# EAGLE schematic module_RevC_panelized (EAGLE 9.1.1)
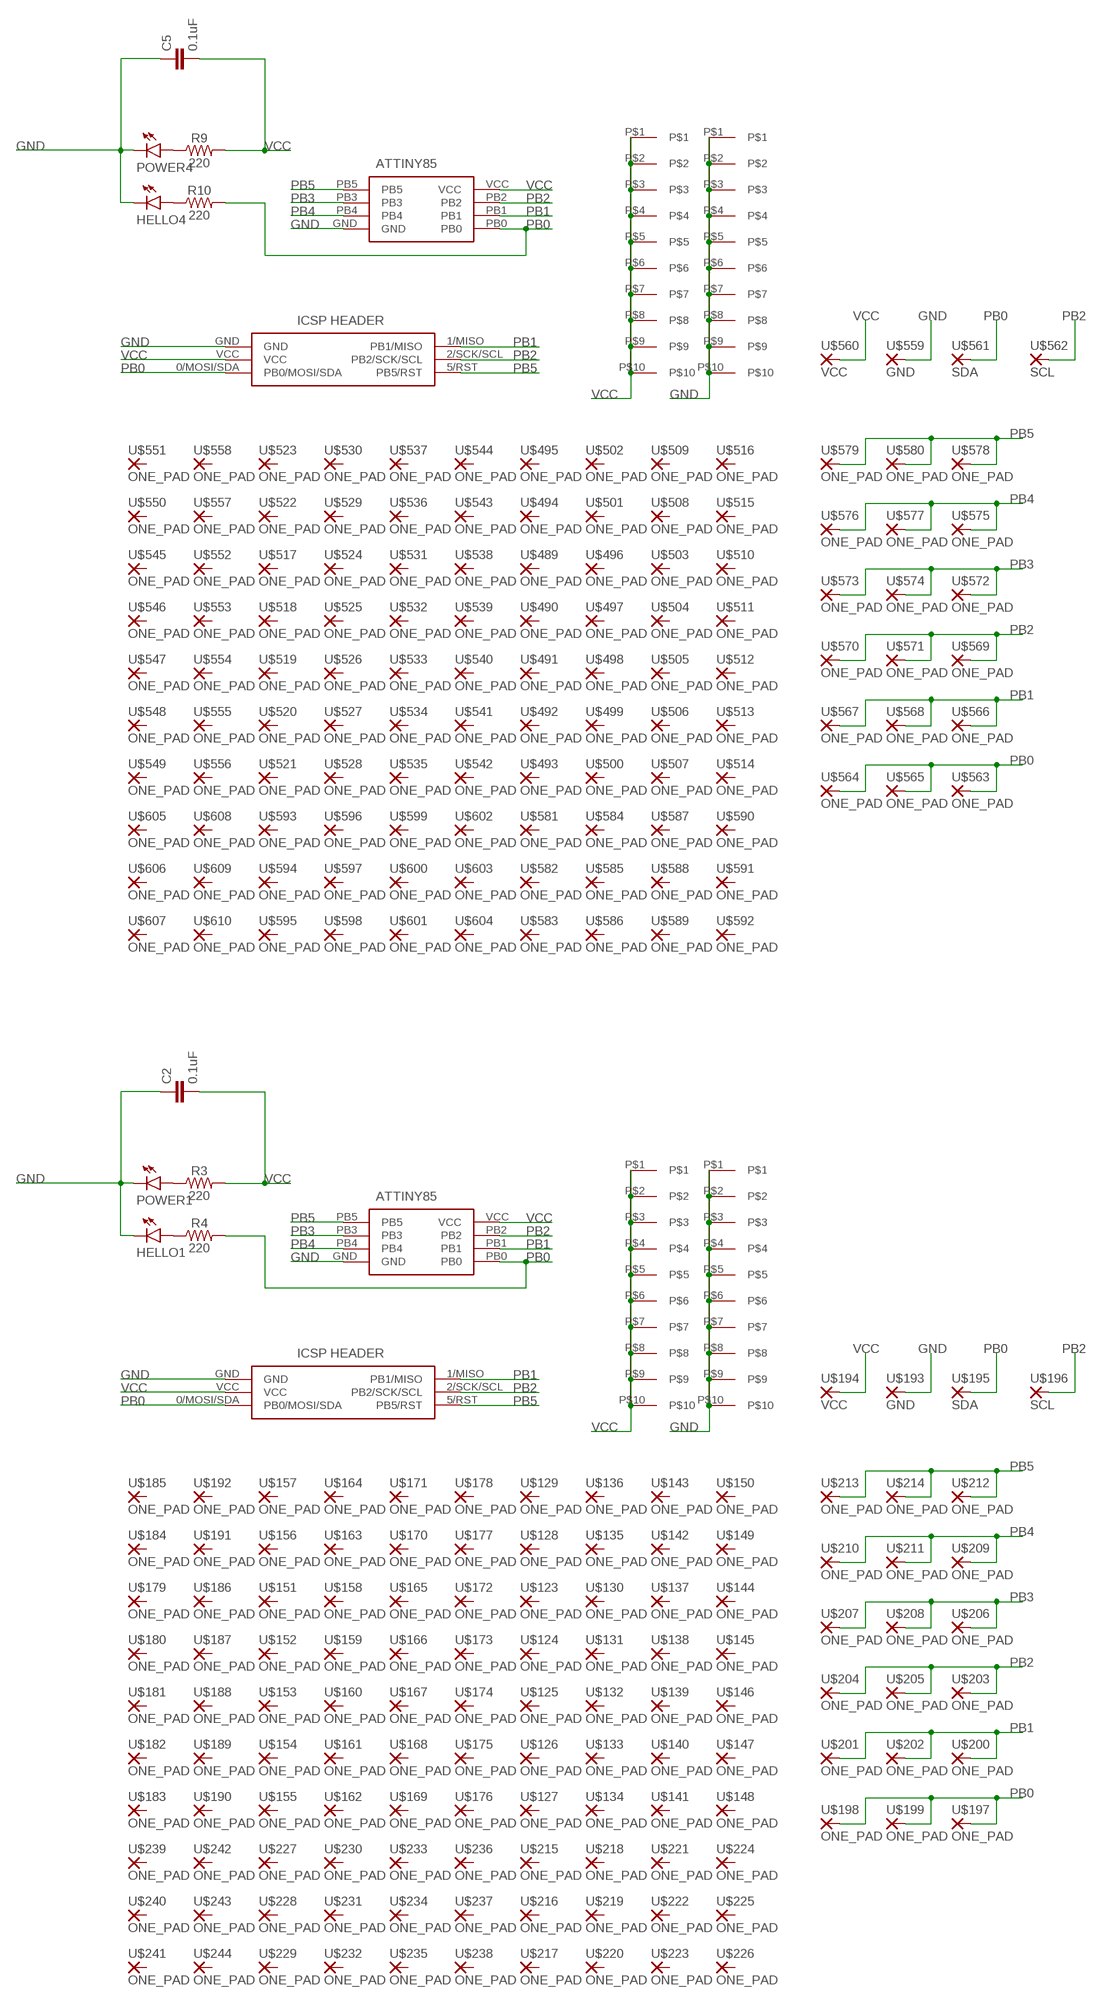
[diagram p0: schematic, sheet 1, part 1 of 2]
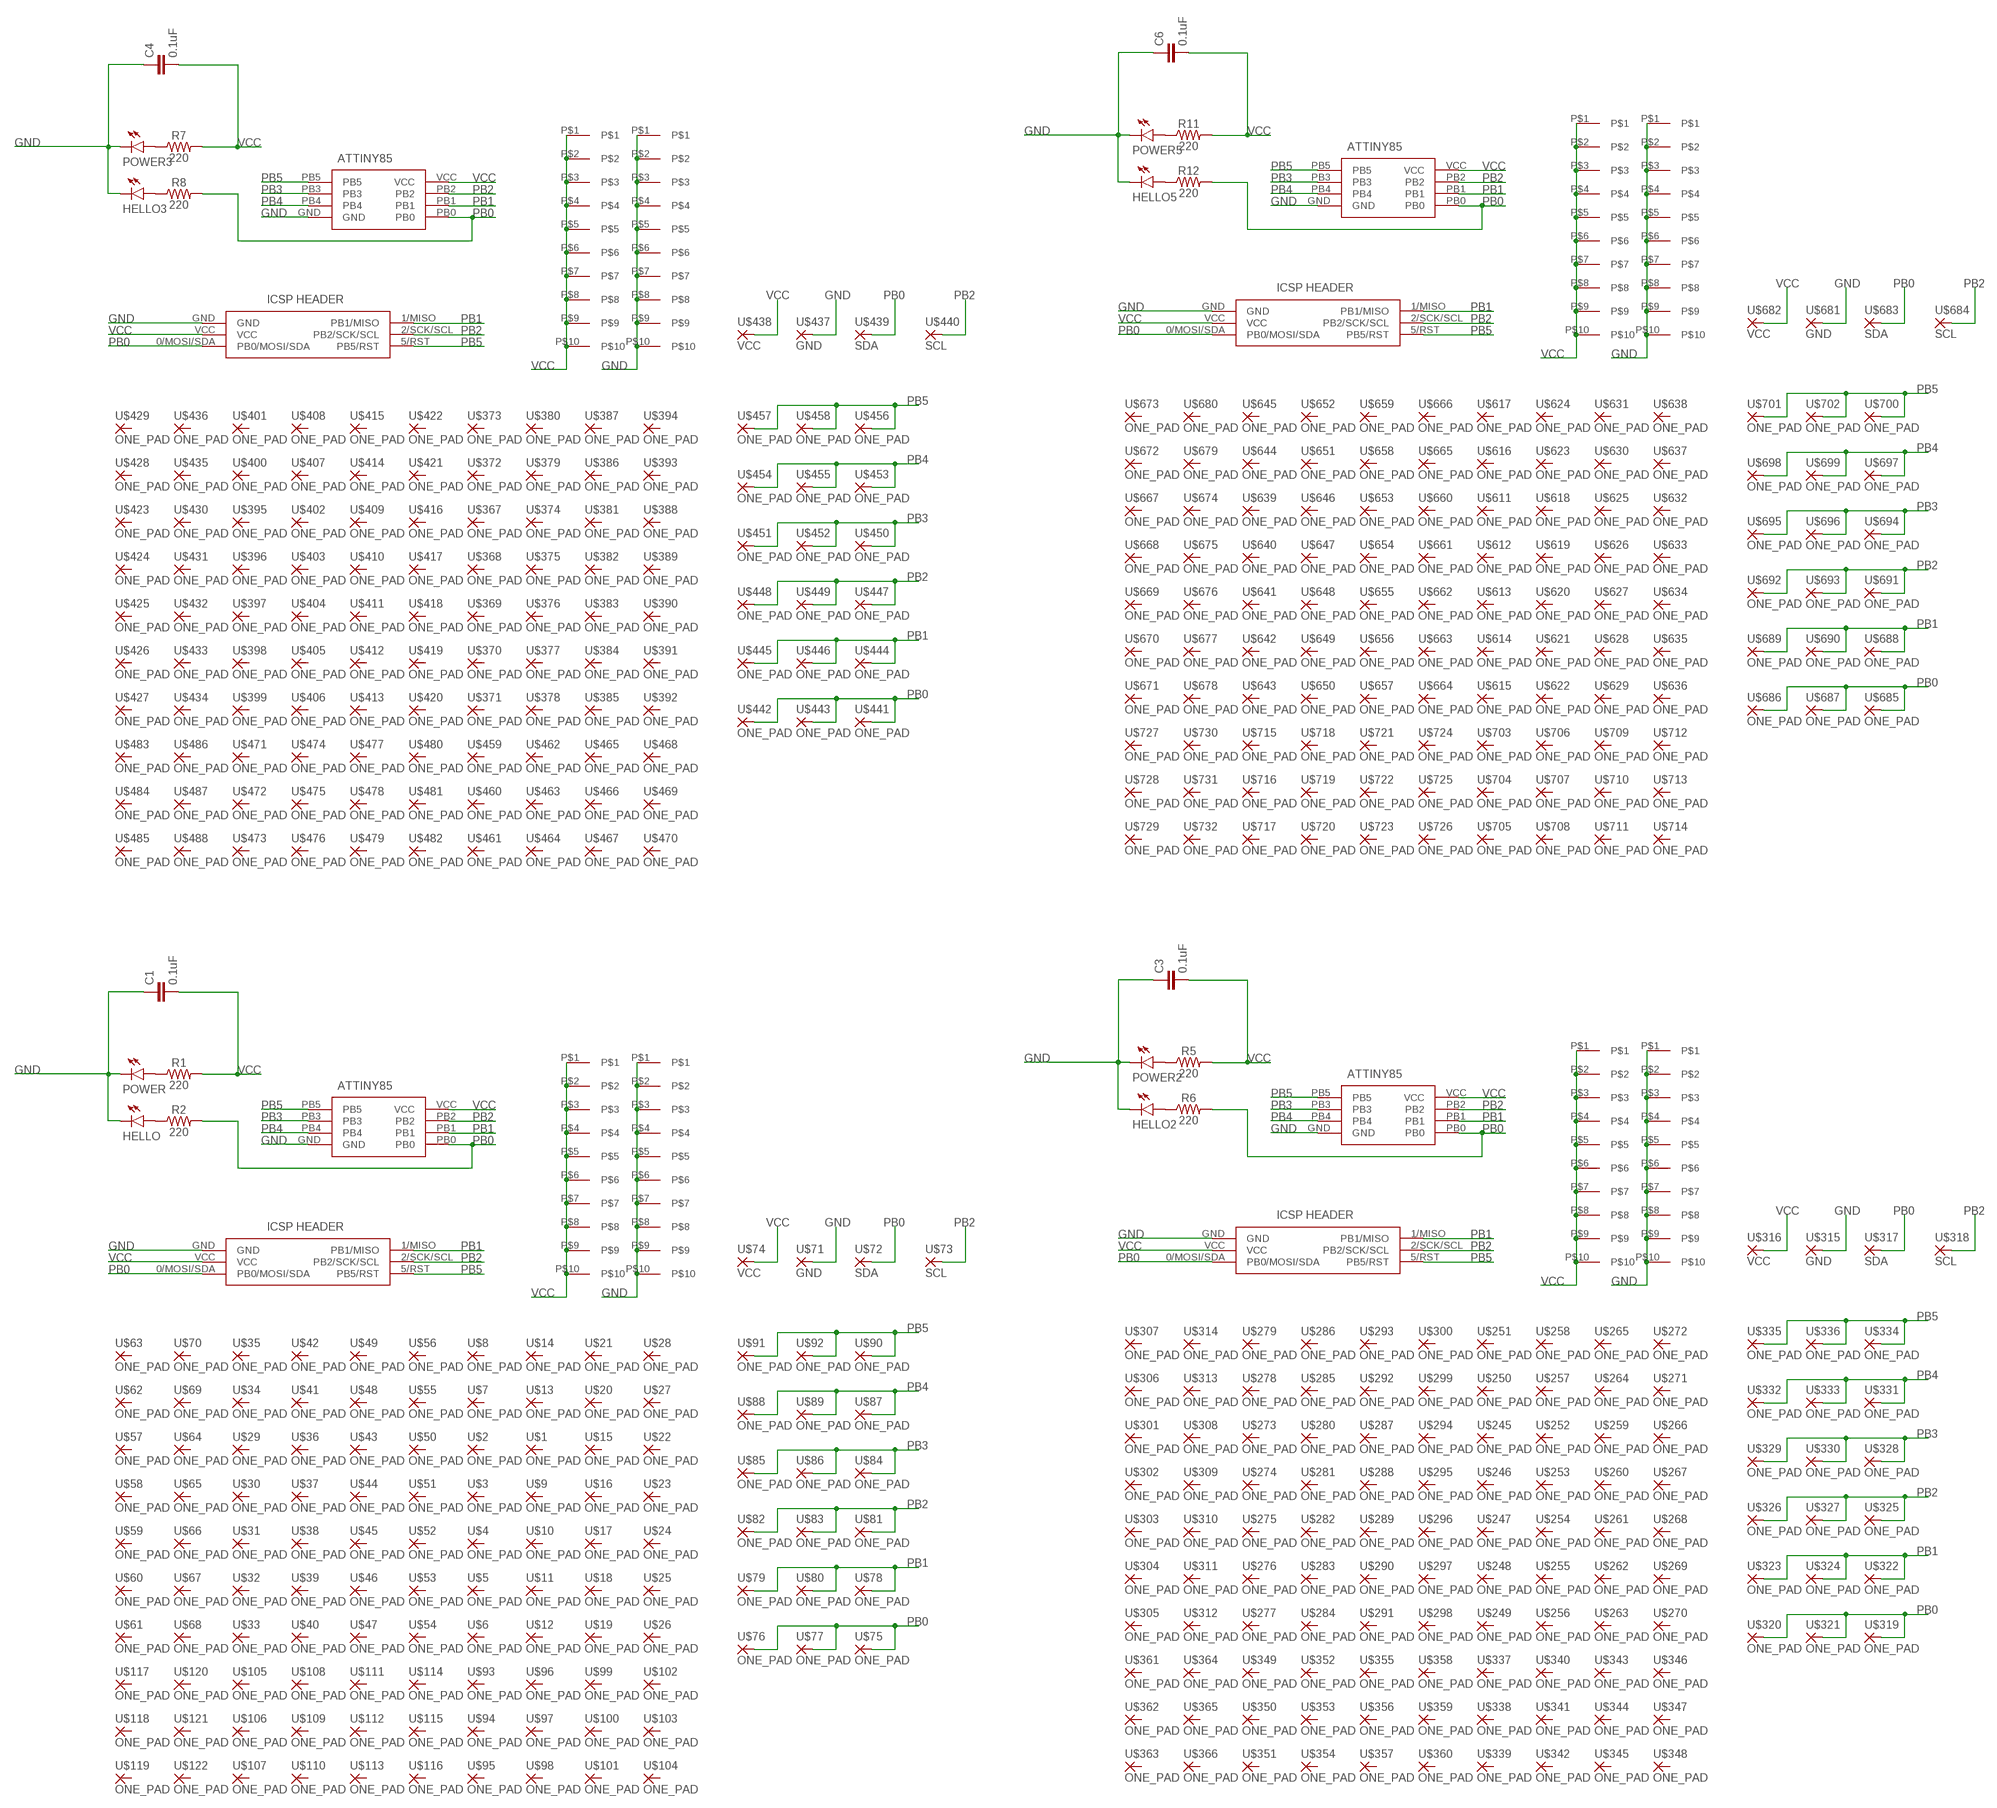
[diagram p1: schematic, sheet 1, part 2 of 2]

## Parts
C1  0.1uF  0.1UF-0603-25V-5%  [0603]
C2  0.1uF  0.1UF-0603-25V-5%  [0603]
C3  0.1uF  0.1UF-0603-25V-5%  [0603]
C4  0.1uF  0.1UF-0603-25V-5%  [0603]
C5  0.1uF  0.1UF-0603-25V-5%  [0603]
C6  0.1uF  0.1UF-0603-25V-5%  [0603]
GND  10X-PADS  [10X-PADS]
GND1  10X-PADS  [10X-PADS]
GND2  10X-PADS  [10X-PADS]
GND3  10X-PADS  [10X-PADS]
GND4  10X-PADS  [10X-PADS]
GND5  10X-PADS  [10X-PADS]
HELLO  LED3MM  [LED3MM]
HELLO1  LED3MM  [LED3MM]
HELLO2  LED3MM  [LED3MM]
HELLO3  LED3MM  [LED3MM]
HELLO4  LED3MM  [LED3MM]
HELLO5  LED3MM  [LED3MM]
IC1  ATTINY85-20SU  [SOT127P798X216-8N]
IC2  ATTINY85-20SU  [SOT127P798X216-8N]
IC3  ATTINY85-20SU  [SOT127P798X216-8N]
IC4  ATTINY85-20SU  [SOT127P798X216-8N]
IC5  ATTINY85-20SU  [SOT127P798X216-8N]
IC6  ATTINY85-20SU  [SOT127P798X216-8N]
J1  M20-9980346  [HDRV6W64P254_2X3_762X508X868P]
J2  M20-9980346  [HDRV6W64P254_2X3_762X508X868P]
J3  M20-9980346  [HDRV6W64P254_2X3_762X508X868P]
J4  M20-9980346  [HDRV6W64P254_2X3_762X508X868P]
J5  M20-9980346  [HDRV6W64P254_2X3_762X508X868P]
J6  M20-9980346  [HDRV6W64P254_2X3_762X508X868P]
POWER  LED3MM  [LED3MM]
POWER1  LED3MM  [LED3MM]
POWER2  LED3MM  [LED3MM]
POWER3  LED3MM  [LED3MM]
POWER4  LED3MM  [LED3MM]
POWER5  LED3MM  [LED3MM]
R1  220  RESISTORAXIAL-0.3  [AXIAL-0.3]
R2  220  RESISTORAXIAL-0.3  [AXIAL-0.3]
R3  220  RESISTORAXIAL-0.3  [AXIAL-0.3]
R4  220  RESISTORAXIAL-0.3  [AXIAL-0.3]
R5  220  RESISTORAXIAL-0.3  [AXIAL-0.3]
R6  220  RESISTORAXIAL-0.3  [AXIAL-0.3]
R7  220  RESISTORAXIAL-0.3  [AXIAL-0.3]
R8  220  RESISTORAXIAL-0.3  [AXIAL-0.3]
R9  220  RESISTORAXIAL-0.3  [AXIAL-0.3]
R10  220  RESISTORAXIAL-0.3  [AXIAL-0.3]
R11  220  RESISTORAXIAL-0.3  [AXIAL-0.3]
R12  220  RESISTORAXIAL-0.3  [AXIAL-0.3]
U$1  ONE_PAD  [1X01]
U$2  ONE_PAD  [1X01]
U$3  ONE_PAD  [1X01]
U$4  ONE_PAD  [1X01]
U$5  ONE_PAD  [1X01]
U$6  ONE_PAD  [1X01]
U$7  ONE_PAD  [1X01]
U$8  ONE_PAD  [1X01]
U$9  ONE_PAD  [1X01]
U$10  ONE_PAD  [1X01]
U$11  ONE_PAD  [1X01]
U$12  ONE_PAD  [1X01]
U$13  ONE_PAD  [1X01]
U$14  ONE_PAD  [1X01]
U$15  ONE_PAD  [1X01]
U$16  ONE_PAD  [1X01]
U$17  ONE_PAD  [1X01]
U$18  ONE_PAD  [1X01]
U$19  ONE_PAD  [1X01]
U$20  ONE_PAD  [1X01]
U$21  ONE_PAD  [1X01]
U$22  ONE_PAD  [1X01]
U$23  ONE_PAD  [1X01]
U$24  ONE_PAD  [1X01]
U$25  ONE_PAD  [1X01]
U$26  ONE_PAD  [1X01]
U$27  ONE_PAD  [1X01]
U$28  ONE_PAD  [1X01]
U$29  ONE_PAD  [1X01]
U$30  ONE_PAD  [1X01]
U$31  ONE_PAD  [1X01]
U$32  ONE_PAD  [1X01]
U$33  ONE_PAD  [1X01]
U$34  ONE_PAD  [1X01]
U$35  ONE_PAD  [1X01]
U$36  ONE_PAD  [1X01]
U$37  ONE_PAD  [1X01]
U$38  ONE_PAD  [1X01]
U$39  ONE_PAD  [1X01]
U$40  ONE_PAD  [1X01]
U$41  ONE_PAD  [1X01]
U$42  ONE_PAD  [1X01]
U$43  ONE_PAD  [1X01]
U$44  ONE_PAD  [1X01]
U$45  ONE_PAD  [1X01]
U$46  ONE_PAD  [1X01]
U$47  ONE_PAD  [1X01]
U$48  ONE_PAD  [1X01]
U$49  ONE_PAD  [1X01]
U$50  ONE_PAD  [1X01]
U$51  ONE_PAD  [1X01]
U$52  ONE_PAD  [1X01]
U$53  ONE_PAD  [1X01]
U$54  ONE_PAD  [1X01]
U$55  ONE_PAD  [1X01]
U$56  ONE_PAD  [1X01]
U$57  ONE_PAD  [1X01]
U$58  ONE_PAD  [1X01]
U$59  ONE_PAD  [1X01]
U$60  ONE_PAD  [1X01]
U$61  ONE_PAD  [1X01]
U$62  ONE_PAD  [1X01]
U$63  ONE_PAD  [1X01]
U$64  ONE_PAD  [1X01]
U$65  ONE_PAD  [1X01]
U$66  ONE_PAD  [1X01]
U$67  ONE_PAD  [1X01]
U$68  ONE_PAD  [1X01]
U$69  ONE_PAD  [1X01]
U$70  ONE_PAD  [1X01]
U$71  GND  ONE_PAD  [1X01]
U$72  SDA  ONE_PAD  [1X01]
U$73  SCL  ONE_PAD  [1X01]
U$74  VCC  ONE_PAD  [1X01]
U$75  ONE_PAD  [1X01]
U$76  ONE_PAD  [1X01]
U$77  ONE_PAD  [1X01]
U$78  ONE_PAD  [1X01]
U$79  ONE_PAD  [1X01]
U$80  ONE_PAD  [1X01]
U$81  ONE_PAD  [1X01]
U$82  ONE_PAD  [1X01]
U$83  ONE_PAD  [1X01]
U$84  ONE_PAD  [1X01]
U$85  ONE_PAD  [1X01]
U$86  ONE_PAD  [1X01]
U$87  ONE_PAD  [1X01]
U$88  ONE_PAD  [1X01]
U$89  ONE_PAD  [1X01]
U$90  ONE_PAD  [1X01]
U$91  ONE_PAD  [1X01]
U$92  ONE_PAD  [1X01]
U$93  ONE_PAD  [1X01]
U$94  ONE_PAD  [1X01]
U$95  ONE_PAD  [1X01]
U$96  ONE_PAD  [1X01]
U$97  ONE_PAD  [1X01]
U$98  ONE_PAD  [1X01]
U$99  ONE_PAD  [1X01]
U$100  ONE_PAD  [1X01]
U$101  ONE_PAD  [1X01]
U$102  ONE_PAD  [1X01]
U$103  ONE_PAD  [1X01]
U$104  ONE_PAD  [1X01]
U$105  ONE_PAD  [1X01]
U$106  ONE_PAD  [1X01]
U$107  ONE_PAD  [1X01]
U$108  ONE_PAD  [1X01]
U$109  ONE_PAD  [1X01]
U$110  ONE_PAD  [1X01]
U$111  ONE_PAD  [1X01]
U$112  ONE_PAD  [1X01]
U$113  ONE_PAD  [1X01]
U$114  ONE_PAD  [1X01]
U$115  ONE_PAD  [1X01]
U$116  ONE_PAD  [1X01]
U$117  ONE_PAD  [1X01]
U$118  ONE_PAD  [1X01]
U$119  ONE_PAD  [1X01]
U$120  ONE_PAD  [1X01]
U$121  ONE_PAD  [1X01]
U$122  ONE_PAD  [1X01]
U$123  ONE_PAD  [1X01]
U$124  ONE_PAD  [1X01]
U$125  ONE_PAD  [1X01]
U$126  ONE_PAD  [1X01]
U$127  ONE_PAD  [1X01]
U$128  ONE_PAD  [1X01]
U$129  ONE_PAD  [1X01]
U$130  ONE_PAD  [1X01]
U$131  ONE_PAD  [1X01]
U$132  ONE_PAD  [1X01]
U$133  ONE_PAD  [1X01]
U$134  ONE_PAD  [1X01]
U$135  ONE_PAD  [1X01]
U$136  ONE_PAD  [1X01]
U$137  ONE_PAD  [1X01]
U$138  ONE_PAD  [1X01]
U$139  ONE_PAD  [1X01]
U$140  ONE_PAD  [1X01]
U$141  ONE_PAD  [1X01]
U$142  ONE_PAD  [1X01]
U$143  ONE_PAD  [1X01]
U$144  ONE_PAD  [1X01]
U$145  ONE_PAD  [1X01]
U$146  ONE_PAD  [1X01]
U$147  ONE_PAD  [1X01]
U$148  ONE_PAD  [1X01]
U$149  ONE_PAD  [1X01]
U$150  ONE_PAD  [1X01]
U$151  ONE_PAD  [1X01]
U$152  ONE_PAD  [1X01]
U$153  ONE_PAD  [1X01]
U$154  ONE_PAD  [1X01]
U$155  ONE_PAD  [1X01]
U$156  ONE_PAD  [1X01]
U$157  ONE_PAD  [1X01]
U$158  ONE_PAD  [1X01]
U$159  ONE_PAD  [1X01]
U$160  ONE_PAD  [1X01]
U$161  ONE_PAD  [1X01]
U$162  ONE_PAD  [1X01]
U$163  ONE_PAD  [1X01]
U$164  ONE_PAD  [1X01]
U$165  ONE_PAD  [1X01]
U$166  ONE_PAD  [1X01]
U$167  ONE_PAD  [1X01]
U$168  ONE_PAD  [1X01]
U$169  ONE_PAD  [1X01]
U$170  ONE_PAD  [1X01]
U$171  ONE_PAD  [1X01]
U$172  ONE_PAD  [1X01]
U$173  ONE_PAD  [1X01]
U$174  ONE_PAD  [1X01]
U$175  ONE_PAD  [1X01]
U$176  ONE_PAD  [1X01]
U$177  ONE_PAD  [1X01]
U$178  ONE_PAD  [1X01]
U$179  ONE_PAD  [1X01]
U$180  ONE_PAD  [1X01]
U$181  ONE_PAD  [1X01]
U$182  ONE_PAD  [1X01]
U$183  ONE_PAD  [1X01]
U$184  ONE_PAD  [1X01]
U$185  ONE_PAD  [1X01]
U$186  ONE_PAD  [1X01]
U$187  ONE_PAD  [1X01]
U$188  ONE_PAD  [1X01]
U$189  ONE_PAD  [1X01]
U$190  ONE_PAD  [1X01]
U$191  ONE_PAD  [1X01]
U$192  ONE_PAD  [1X01]
U$193  GND  ONE_PAD  [1X01]
U$194  VCC  ONE_PAD  [1X01]
U$195  SDA  ONE_PAD  [1X01]
U$196  SCL  ONE_PAD  [1X01]
U$197  ONE_PAD  [1X01]
U$198  ONE_PAD  [1X01]
U$199  ONE_PAD  [1X01]
U$200  ONE_PAD  [1X01]
U$201  ONE_PAD  [1X01]
U$202  ONE_PAD  [1X01]
U$203  ONE_PAD  [1X01]
U$204  ONE_PAD  [1X01]
U$205  ONE_PAD  [1X01]
U$206  ONE_PAD  [1X01]
U$207  ONE_PAD  [1X01]
U$208  ONE_PAD  [1X01]
U$209  ONE_PAD  [1X01]
U$210  ONE_PAD  [1X01]
U$211  ONE_PAD  [1X01]
U$212  ONE_PAD  [1X01]
U$213  ONE_PAD  [1X01]
U$214  ONE_PAD  [1X01]
U$215  ONE_PAD  [1X01]
U$216  ONE_PAD  [1X01]
U$217  ONE_PAD  [1X01]
U$218  ONE_PAD  [1X01]
U$219  ONE_PAD  [1X01]
U$220  ONE_PAD  [1X01]
U$221  ONE_PAD  [1X01]
U$222  ONE_PAD  [1X01]
U$223  ONE_PAD  [1X01]
U$224  ONE_PAD  [1X01]
U$225  ONE_PAD  [1X01]
U$226  ONE_PAD  [1X01]
U$227  ONE_PAD  [1X01]
U$228  ONE_PAD  [1X01]
U$229  ONE_PAD  [1X01]
U$230  ONE_PAD  [1X01]
U$231  ONE_PAD  [1X01]
U$232  ONE_PAD  [1X01]
U$233  ONE_PAD  [1X01]
U$234  ONE_PAD  [1X01]
U$235  ONE_PAD  [1X01]
U$236  ONE_PAD  [1X01]
U$237  ONE_PAD  [1X01]
U$238  ONE_PAD  [1X01]
U$239  ONE_PAD  [1X01]
U$240  ONE_PAD  [1X01]
U$241  ONE_PAD  [1X01]
U$242  ONE_PAD  [1X01]
U$243  ONE_PAD  [1X01]
U$244  ONE_PAD  [1X01]
U$245  ONE_PAD  [1X01]
U$246  ONE_PAD  [1X01]
U$247  ONE_PAD  [1X01]
U$248  ONE_PAD  [1X01]
U$249  ONE_PAD  [1X01]
U$250  ONE_PAD  [1X01]
U$251  ONE_PAD  [1X01]
U$252  ONE_PAD  [1X01]
U$253  ONE_PAD  [1X01]
U$254  ONE_PAD  [1X01]
U$255  ONE_PAD  [1X01]
U$256  ONE_PAD  [1X01]
U$257  ONE_PAD  [1X01]
U$258  ONE_PAD  [1X01]
U$259  ONE_PAD  [1X01]
U$260  ONE_PAD  [1X01]
U$261  ONE_PAD  [1X01]
U$262  ONE_PAD  [1X01]
U$263  ONE_PAD  [1X01]
U$264  ONE_PAD  [1X01]
U$265  ONE_PAD  [1X01]
U$266  ONE_PAD  [1X01]
U$267  ONE_PAD  [1X01]
U$268  ONE_PAD  [1X01]
U$269  ONE_PAD  [1X01]
U$270  ONE_PAD  [1X01]
U$271  ONE_PAD  [1X01]
U$272  ONE_PAD  [1X01]
U$273  ONE_PAD  [1X01]
U$274  ONE_PAD  [1X01]
U$275  ONE_PAD  [1X01]
U$276  ONE_PAD  [1X01]
U$277  ONE_PAD  [1X01]
U$278  ONE_PAD  [1X01]
U$279  ONE_PAD  [1X01]
U$280  ONE_PAD  [1X01]
U$281  ONE_PAD  [1X01]
U$282  ONE_PAD  [1X01]
U$283  ONE_PAD  [1X01]
U$284  ONE_PAD  [1X01]
U$285  ONE_PAD  [1X01]
U$286  ONE_PAD  [1X01]
U$287  ONE_PAD  [1X01]
U$288  ONE_PAD  [1X01]
U$289  ONE_PAD  [1X01]
U$290  ONE_PAD  [1X01]
U$291  ONE_PAD  [1X01]
U$292  ONE_PAD  [1X01]
U$293  ONE_PAD  [1X01]
U$294  ONE_PAD  [1X01]
U$295  ONE_PAD  [1X01]
U$296  ONE_PAD  [1X01]
U$297  ONE_PAD  [1X01]
U$298  ONE_PAD  [1X01]
U$299  ONE_PAD  [1X01]
U$300  ONE_PAD  [1X01]
U$301  ONE_PAD  [1X01]
U$302  ONE_PAD  [1X01]
U$303  ONE_PAD  [1X01]
U$304  ONE_PAD  [1X01]
U$305  ONE_PAD  [1X01]
U$306  ONE_PAD  [1X01]
U$307  ONE_PAD  [1X01]
U$308  ONE_PAD  [1X01]
U$309  ONE_PAD  [1X01]
U$310  ONE_PAD  [1X01]
U$311  ONE_PAD  [1X01]
U$312  ONE_PAD  [1X01]
U$313  ONE_PAD  [1X01]
U$314  ONE_PAD  [1X01]
U$315  GND  ONE_PAD  [1X01]
U$316  VCC  ONE_PAD  [1X01]
U$317  SDA  ONE_PAD  [1X01]
U$318  SCL  ONE_PAD  [1X01]
U$319  ONE_PAD  [1X01]
U$320  ONE_PAD  [1X01]
U$321  ONE_PAD  [1X01]
U$322  ONE_PAD  [1X01]
U$323  ONE_PAD  [1X01]
U$324  ONE_PAD  [1X01]
U$325  ONE_PAD  [1X01]
U$326  ONE_PAD  [1X01]
U$327  ONE_PAD  [1X01]
U$328  ONE_PAD  [1X01]
U$329  ONE_PAD  [1X01]
U$330  ONE_PAD  [1X01]
U$331  ONE_PAD  [1X01]
U$332  ONE_PAD  [1X01]
U$333  ONE_PAD  [1X01]
U$334  ONE_PAD  [1X01]
U$335  ONE_PAD  [1X01]
U$336  ONE_PAD  [1X01]
U$337  ONE_PAD  [1X01]
U$338  ONE_PAD  [1X01]
U$339  ONE_PAD  [1X01]
U$340  ONE_PAD  [1X01]
U$341  ONE_PAD  [1X01]
U$342  ONE_PAD  [1X01]
U$343  ONE_PAD  [1X01]
U$344  ONE_PAD  [1X01]
U$345  ONE_PAD  [1X01]
U$346  ONE_PAD  [1X01]
U$347  ONE_PAD  [1X01]
U$348  ONE_PAD  [1X01]
U$349  ONE_PAD  [1X01]
U$350  ONE_PAD  [1X01]
U$351  ONE_PAD  [1X01]
U$352  ONE_PAD  [1X01]
U$353  ONE_PAD  [1X01]
U$354  ONE_PAD  [1X01]
U$355  ONE_PAD  [1X01]
U$356  ONE_PAD  [1X01]
U$357  ONE_PAD  [1X01]
U$358  ONE_PAD  [1X01]
U$359  ONE_PAD  [1X01]
U$360  ONE_PAD  [1X01]
U$361  ONE_PAD  [1X01]
U$362  ONE_PAD  [1X01]
U$363  ONE_PAD  [1X01]
U$364  ONE_PAD  [1X01]
U$365  ONE_PAD  [1X01]
U$366  ONE_PAD  [1X01]
U$367  ONE_PAD  [1X01]
U$368  ONE_PAD  [1X01]
U$369  ONE_PAD  [1X01]
U$370  ONE_PAD  [1X01]
U$371  ONE_PAD  [1X01]
U$372  ONE_PAD  [1X01]
U$373  ONE_PAD  [1X01]
U$374  ONE_PAD  [1X01]
U$375  ONE_PAD  [1X01]
U$376  ONE_PAD  [1X01]
U$377  ONE_PAD  [1X01]
U$378  ONE_PAD  [1X01]
U$379  ONE_PAD  [1X01]
U$380  ONE_PAD  [1X01]
U$381  ONE_PAD  [1X01]
U$382  ONE_PAD  [1X01]
U$383  ONE_PAD  [1X01]
U$384  ONE_PAD  [1X01]
U$385  ONE_PAD  [1X01]
U$386  ONE_PAD  [1X01]
U$387  ONE_PAD  [1X01]
U$388  ONE_PAD  [1X01]
U$389  ONE_PAD  [1X01]
U$390  ONE_PAD  [1X01]
U$391  ONE_PAD  [1X01]
U$392  ONE_PAD  [1X01]
U$393  ONE_PAD  [1X01]
U$394  ONE_PAD  [1X01]
U$395  ONE_PAD  [1X01]
U$396  ONE_PAD  [1X01]
U$397  ONE_PAD  [1X01]
U$398  ONE_PAD  [1X01]
U$399  ONE_PAD  [1X01]
U$400  ONE_PAD  [1X01]
U$401  ONE_PAD  [1X01]
U$402  ONE_PAD  [1X01]
U$403  ONE_PAD  [1X01]
U$404  ONE_PAD  [1X01]
U$405  ONE_PAD  [1X01]
U$406  ONE_PAD  [1X01]
U$407  ONE_PAD  [1X01]
U$408  ONE_PAD  [1X01]
U$409  ONE_PAD  [1X01]
U$410  ONE_PAD  [1X01]
U$411  ONE_PAD  [1X01]
U$412  ONE_PAD  [1X01]
U$413  ONE_PAD  [1X01]
U$414  ONE_PAD  [1X01]
U$415  ONE_PAD  [1X01]
U$416  ONE_PAD  [1X01]
U$417  ONE_PAD  [1X01]
U$418  ONE_PAD  [1X01]
U$419  ONE_PAD  [1X01]
U$420  ONE_PAD  [1X01]
U$421  ONE_PAD  [1X01]
U$422  ONE_PAD  [1X01]
U$423  ONE_PAD  [1X01]
U$424  ONE_PAD  [1X01]
U$425  ONE_PAD  [1X01]
U$426  ONE_PAD  [1X01]
U$427  ONE_PAD  [1X01]
U$428  ONE_PAD  [1X01]
U$429  ONE_PAD  [1X01]
U$430  ONE_PAD  [1X01]
U$431  ONE_PAD  [1X01]
U$432  ONE_PAD  [1X01]
U$433  ONE_PAD  [1X01]
U$434  ONE_PAD  [1X01]
U$435  ONE_PAD  [1X01]
U$436  ONE_PAD  [1X01]
U$437  GND  ONE_PAD  [1X01]
U$438  VCC  ONE_PAD  [1X01]
U$439  SDA  ONE_PAD  [1X01]
U$440  SCL  ONE_PAD  [1X01]
U$441  ONE_PAD  [1X01]
U$442  ONE_PAD  [1X01]
U$443  ONE_PAD  [1X01]
U$444  ONE_PAD  [1X01]
U$445  ONE_PAD  [1X01]
U$446  ONE_PAD  [1X01]
U$447  ONE_PAD  [1X01]
U$448  ONE_PAD  [1X01]
U$449  ONE_PAD  [1X01]
U$450  ONE_PAD  [1X01]
U$451  ONE_PAD  [1X01]
U$452  ONE_PAD  [1X01]
U$453  ONE_PAD  [1X01]
U$454  ONE_PAD  [1X01]
U$455  ONE_PAD  [1X01]
U$456  ONE_PAD  [1X01]
U$457  ONE_PAD  [1X01]
U$458  ONE_PAD  [1X01]
U$459  ONE_PAD  [1X01]
U$460  ONE_PAD  [1X01]
U$461  ONE_PAD  [1X01]
U$462  ONE_PAD  [1X01]
U$463  ONE_PAD  [1X01]
U$464  ONE_PAD  [1X01]
U$465  ONE_PAD  [1X01]
U$466  ONE_PAD  [1X01]
U$467  ONE_PAD  [1X01]
U$468  ONE_PAD  [1X01]
U$469  ONE_PAD  [1X01]
U$470  ONE_PAD  [1X01]
U$471  ONE_PAD  [1X01]
U$472  ONE_PAD  [1X01]
U$473  ONE_PAD  [1X01]
U$474  ONE_PAD  [1X01]
U$475  ONE_PAD  [1X01]
U$476  ONE_PAD  [1X01]
U$477  ONE_PAD  [1X01]
U$478  ONE_PAD  [1X01]
U$479  ONE_PAD  [1X01]
U$480  ONE_PAD  [1X01]
U$481  ONE_PAD  [1X01]
U$482  ONE_PAD  [1X01]
U$483  ONE_PAD  [1X01]
U$484  ONE_PAD  [1X01]
U$485  ONE_PAD  [1X01]
U$486  ONE_PAD  [1X01]
U$487  ONE_PAD  [1X01]
U$488  ONE_PAD  [1X01]
U$489  ONE_PAD  [1X01]
U$490  ONE_PAD  [1X01]
U$491  ONE_PAD  [1X01]
U$492  ONE_PAD  [1X01]
U$493  ONE_PAD  [1X01]
U$494  ONE_PAD  [1X01]
U$495  ONE_PAD  [1X01]
U$496  ONE_PAD  [1X01]
U$497  ONE_PAD  [1X01]
U$498  ONE_PAD  [1X01]
U$499  ONE_PAD  [1X01]
U$500  ONE_PAD  [1X01]
U$501  ONE_PAD  [1X01]
U$502  ONE_PAD  [1X01]
U$503  ONE_PAD  [1X01]
U$504  ONE_PAD  [1X01]
U$505  ONE_PAD  [1X01]
U$506  ONE_PAD  [1X01]
U$507  ONE_PAD  [1X01]
U$508  ONE_PAD  [1X01]
U$509  ONE_PAD  [1X01]
U$510  ONE_PAD  [1X01]
U$511  ONE_PAD  [1X01]
U$512  ONE_PAD  [1X01]
U$513  ONE_PAD  [1X01]
U$514  ONE_PAD  [1X01]
U$515  ONE_PAD  [1X01]
U$516  ONE_PAD  [1X01]
U$517  ONE_PAD  [1X01]
U$518  ONE_PAD  [1X01]
U$519  ONE_PAD  [1X01]
U$520  ONE_PAD  [1X01]
U$521  ONE_PAD  [1X01]
U$522  ONE_PAD  [1X01]
U$523  ONE_PAD  [1X01]
U$524  ONE_PAD  [1X01]
U$525  ONE_PAD  [1X01]
U$526  ONE_PAD  [1X01]
U$527  ONE_PAD  [1X01]
U$528  ONE_PAD  [1X01]
U$529  ONE_PAD  [1X01]
U$530  ONE_PAD  [1X01]
U$531  ONE_PAD  [1X01]
U$532  ONE_PAD  [1X01]
U$533  ONE_PAD  [1X01]
U$534  ONE_PAD  [1X01]
U$535  ONE_PAD  [1X01]
U$536  ONE_PAD  [1X01]
U$537  ONE_PAD  [1X01]
U$538  ONE_PAD  [1X01]
U$539  ONE_PAD  [1X01]
U$540  ONE_PAD  [1X01]
U$541  ONE_PAD  [1X01]
U$542  ONE_PAD  [1X01]
U$543  ONE_PAD  [1X01]
U$544  ONE_PAD  [1X01]
U$545  ONE_PAD  [1X01]
U$546  ONE_PAD  [1X01]
U$547  ONE_PAD  [1X01]
U$548  ONE_PAD  [1X01]
U$549  ONE_PAD  [1X01]
U$550  ONE_PAD  [1X01]
U$551  ONE_PAD  [1X01]
U$552  ONE_PAD  [1X01]
U$553  ONE_PAD  [1X01]
U$554  ONE_PAD  [1X01]
U$555  ONE_PAD  [1X01]
U$556  ONE_PAD  [1X01]
U$557  ONE_PAD  [1X01]
U$558  ONE_PAD  [1X01]
U$559  GND  ONE_PAD  [1X01]
U$560  VCC  ONE_PAD  [1X01]
U$561  SDA  ONE_PAD  [1X01]
U$562  SCL  ONE_PAD  [1X01]
U$563  ONE_PAD  [1X01]
U$564  ONE_PAD  [1X01]
U$565  ONE_PAD  [1X01]
U$566  ONE_PAD  [1X01]
U$567  ONE_PAD  [1X01]
U$568  ONE_PAD  [1X01]
U$569  ONE_PAD  [1X01]
U$570  ONE_PAD  [1X01]
U$571  ONE_PAD  [1X01]
U$572  ONE_PAD  [1X01]
U$573  ONE_PAD  [1X01]
U$574  ONE_PAD  [1X01]
U$575  ONE_PAD  [1X01]
U$576  ONE_PAD  [1X01]
U$577  ONE_PAD  [1X01]
U$578  ONE_PAD  [1X01]
U$579  ONE_PAD  [1X01]
U$580  ONE_PAD  [1X01]
U$581  ONE_PAD  [1X01]
U$582  ONE_PAD  [1X01]
U$583  ONE_PAD  [1X01]
U$584  ONE_PAD  [1X01]
U$585  ONE_PAD  [1X01]
U$586  ONE_PAD  [1X01]
U$587  ONE_PAD  [1X01]
U$588  ONE_PAD  [1X01]
U$589  ONE_PAD  [1X01]
U$590  ONE_PAD  [1X01]
U$591  ONE_PAD  [1X01]
U$592  ONE_PAD  [1X01]
U$593  ONE_PAD  [1X01]
U$594  ONE_PAD  [1X01]
U$595  ONE_PAD  [1X01]
U$596  ONE_PAD  [1X01]
U$597  ONE_PAD  [1X01]
U$598  ONE_PAD  [1X01]
U$599  ONE_PAD  [1X01]
U$600  ONE_PAD  [1X01]
U$601  ONE_PAD  [1X01]
U$602  ONE_PAD  [1X01]
U$603  ONE_PAD  [1X01]
U$604  ONE_PAD  [1X01]
U$605  ONE_PAD  [1X01]
U$606  ONE_PAD  [1X01]
U$607  ONE_PAD  [1X01]
U$608  ONE_PAD  [1X01]
U$609  ONE_PAD  [1X01]
U$610  ONE_PAD  [1X01]
U$611  ONE_PAD  [1X01]
U$612  ONE_PAD  [1X01]
U$613  ONE_PAD  [1X01]
U$614  ONE_PAD  [1X01]
U$615  ONE_PAD  [1X01]
U$616  ONE_PAD  [1X01]
U$617  ONE_PAD  [1X01]
U$618  ONE_PAD  [1X01]
U$619  ONE_PAD  [1X01]
U$620  ONE_PAD  [1X01]
U$621  ONE_PAD  [1X01]
U$622  ONE_PAD  [1X01]
U$623  ONE_PAD  [1X01]
U$624  ONE_PAD  [1X01]
U$625  ONE_PAD  [1X01]
U$626  ONE_PAD  [1X01]
U$627  ONE_PAD  [1X01]
U$628  ONE_PAD  [1X01]
U$629  ONE_PAD  [1X01]
U$630  ONE_PAD  [1X01]
U$631  ONE_PAD  [1X01]
U$632  ONE_PAD  [1X01]
U$633  ONE_PAD  [1X01]
U$634  ONE_PAD  [1X01]
U$635  ONE_PAD  [1X01]
U$636  ONE_PAD  [1X01]
U$637  ONE_PAD  [1X01]
U$638  ONE_PAD  [1X01]
U$639  ONE_PAD  [1X01]
U$640  ONE_PAD  [1X01]
U$641  ONE_PAD  [1X01]
U$642  ONE_PAD  [1X01]
U$643  ONE_PAD  [1X01]
U$644  ONE_PAD  [1X01]
U$645  ONE_PAD  [1X01]
U$646  ONE_PAD  [1X01]
U$647  ONE_PAD  [1X01]
U$648  ONE_PAD  [1X01]
U$649  ONE_PAD  [1X01]
U$650  ONE_PAD  [1X01]
U$651  ONE_PAD  [1X01]
U$652  ONE_PAD  [1X01]
U$653  ONE_PAD  [1X01]
U$654  ONE_PAD  [1X01]
U$655  ONE_PAD  [1X01]
U$656  ONE_PAD  [1X01]
U$657  ONE_PAD  [1X01]
U$658  ONE_PAD  [1X01]
U$659  ONE_PAD  [1X01]
U$660  ONE_PAD  [1X01]
U$661  ONE_PAD  [1X01]
U$662  ONE_PAD  [1X01]
U$663  ONE_PAD  [1X01]
U$664  ONE_PAD  [1X01]
U$665  ONE_PAD  [1X01]
U$666  ONE_PAD  [1X01]
U$667  ONE_PAD  [1X01]
U$668  ONE_PAD  [1X01]
U$669  ONE_PAD  [1X01]
U$670  ONE_PAD  [1X01]
U$671  ONE_PAD  [1X01]
U$672  ONE_PAD  [1X01]
U$673  ONE_PAD  [1X01]
U$674  ONE_PAD  [1X01]
U$675  ONE_PAD  [1X01]
U$676  ONE_PAD  [1X01]
U$677  ONE_PAD  [1X01]
U$678  ONE_PAD  [1X01]
U$679  ONE_PAD  [1X01]
U$680  ONE_PAD  [1X01]
U$681  GND  ONE_PAD  [1X01]
U$682  VCC  ONE_PAD  [1X01]
U$683  SDA  ONE_PAD  [1X01]
U$684  SCL  ONE_PAD  [1X01]
U$685  ONE_PAD  [1X01]
U$686  ONE_PAD  [1X01]
U$687  ONE_PAD  [1X01]
U$688  ONE_PAD  [1X01]
U$689  ONE_PAD  [1X01]
U$690  ONE_PAD  [1X01]
U$691  ONE_PAD  [1X01]
U$692  ONE_PAD  [1X01]
U$693  ONE_PAD  [1X01]
U$694  ONE_PAD  [1X01]
U$695  ONE_PAD  [1X01]
U$696  ONE_PAD  [1X01]
U$697  ONE_PAD  [1X01]
U$698  ONE_PAD  [1X01]
U$699  ONE_PAD  [1X01]
U$700  ONE_PAD  [1X01]
U$701  ONE_PAD  [1X01]
U$702  ONE_PAD  [1X01]
U$703  ONE_PAD  [1X01]
U$704  ONE_PAD  [1X01]
U$705  ONE_PAD  [1X01]
U$706  ONE_PAD  [1X01]
U$707  ONE_PAD  [1X01]
U$708  ONE_PAD  [1X01]
U$709  ONE_PAD  [1X01]
U$710  ONE_PAD  [1X01]
U$711  ONE_PAD  [1X01]
U$712  ONE_PAD  [1X01]
U$713  ONE_PAD  [1X01]
U$714  ONE_PAD  [1X01]
U$715  ONE_PAD  [1X01]
U$716  ONE_PAD  [1X01]
U$717  ONE_PAD  [1X01]
U$718  ONE_PAD  [1X01]
U$719  ONE_PAD  [1X01]
U$720  ONE_PAD  [1X01]
U$721  ONE_PAD  [1X01]
U$722  ONE_PAD  [1X01]
U$723  ONE_PAD  [1X01]
U$724  ONE_PAD  [1X01]
U$725  ONE_PAD  [1X01]
U$726  ONE_PAD  [1X01]
U$727  ONE_PAD  [1X01]
U$728  ONE_PAD  [1X01]
U$729  ONE_PAD  [1X01]
U$730  ONE_PAD  [1X01]
U$731  ONE_PAD  [1X01]
U$732  ONE_PAD  [1X01]
VCC  10X-PADS  [10X-PADS]
VCC1  10X-PADS  [10X-PADS]
VCC2  10X-PADS  [10X-PADS]
VCC3  10X-PADS  [10X-PADS]
VCC4  10X-PADS  [10X-PADS]
VCC5  10X-PADS  [10X-PADS]

## Nets
GND [GND]: C1.1 C2.1 C3.1 C4.1 C5.1 C6.1 GND1.P$1 GND1.P$2 GND1.P$3 GND1.P$4 GND1.P$5 GND1.P$6 GND1.P$7 GND1.P$8 GND1.P$9 GND1.P$10 GND2.P$1 GND2.P$2 GND2.P$3 GND2.P$4 GND2.P$5 GND2.P$6 GND2.P$7 GND2.P$8 GND2.P$9 GND2.P$10 GND3.P$1 GND3.P$2 GND3.P$3 GND3.P$4 GND3.P$5 GND3.P$6 GND3.P$7 GND3.P$8 GND3.P$9 GND3.P$10 GND4.P$1 GND4.P$2 GND4.P$3 GND4.P$4 GND4.P$5 GND4.P$6 GND4.P$7 GND4.P$8 GND4.P$9 GND4.P$10 GND5.P$1 GND5.P$2 GND5.P$3 GND5.P$4 GND5.P$5 GND5.P$6 GND5.P$7 GND5.P$8 GND5.P$9 GND5.P$10 GND.P$1 GND.P$2 GND.P$3 GND.P$4 GND.P$5 GND.P$6 GND.P$7 GND.P$8 GND.P$9 GND.P$10 HELLO1.NEG HELLO2.NEG HELLO3.NEG HELLO4.NEG HELLO5.NEG HELLO.NEG IC1.GND IC2.GND IC3.GND IC4.GND IC5.GND IC6.GND J1.GND J2.GND J3.GND J4.GND J5.GND J6.GND POWER1.NEG POWER2.NEG POWER3.NEG POWER4.NEG POWER5.NEG POWER.NEG U$71.1(P) U$193.1(P) U$315.1(P) U$437.1(P) U$559.1(P) U$681.1(P)
N$1: POWER.POS R1.P$1
N$2: POWER1.POS R3.P$1
N$3: HELLO.POS R2.P$1
N$4: HELLO1.POS R4.P$1
N$5: POWER2.POS R5.P$1
N$6: HELLO2.POS R6.P$1
N$7: POWER3.POS R7.P$1
N$8: HELLO3.POS R8.P$1
N$9: POWER4.POS R9.P$1
N$10: HELLO4.POS R10.P$1
N$11: POWER5.POS R11.P$1
N$12: HELLO5.POS R12.P$1
PB0: IC1.PB0 IC2.PB0 IC3.PB0 IC4.PB0 IC5.PB0 IC6.PB0 J1.0/MOSI/SDA(PB0/MOSI/SDA) J2.0/MOSI/SDA(PB0/MOSI/SDA) J3.0/MOSI/SDA(PB0/MOSI/SDA) J4.0/MOSI/SDA(PB0/MOSI/SDA) J5.0/MOSI/SDA(PB0/MOSI/SDA) J6.0/MOSI/SDA(PB0/MOSI/SDA) R2.P$2 R4.P$2 R6.P$2 R8.P$2 R10.P$2 R12.P$2 U$72.1(P) U$75.1(P) U$76.1(P) U$77.1(P) U$195.1(P) U$197.1(P) U$198.1(P) U$199.1(P) U$317.1(P) U$319.1(P) U$320.1(P) U$321.1(P) U$439.1(P) U$441.1(P) U$442.1(P) U$443.1(P) U$561.1(P) U$563.1(P) U$564.1(P) U$565.1(P) U$683.1(P) U$685.1(P) U$686.1(P) U$687.1(P)
PB1: IC1.PB1 IC2.PB1 IC3.PB1 IC4.PB1 IC5.PB1 IC6.PB1 J1.1/MISO(PB1/MISO) J2.1/MISO(PB1/MISO) J3.1/MISO(PB1/MISO) J4.1/MISO(PB1/MISO) J5.1/MISO(PB1/MISO) J6.1/MISO(PB1/MISO) U$78.1(P) U$79.1(P) U$80.1(P) U$200.1(P) U$201.1(P) U$202.1(P) U$322.1(P) U$323.1(P) U$324.1(P) U$444.1(P) U$445.1(P) U$446.1(P) U$566.1(P) U$567.1(P) U$568.1(P) U$688.1(P) U$689.1(P) U$690.1(P)
PB2: IC1.PB2 IC2.PB2 IC3.PB2 IC4.PB2 IC5.PB2 IC6.PB2 J1.2/SCK/SCL(PB2/SCK/SCL) J2.2/SCK/SCL(PB2/SCK/SCL) J3.2/SCK/SCL(PB2/SCK/SCL) J4.2/SCK/SCL(PB2/SCK/SCL) J5.2/SCK/SCL(PB2/SCK/SCL) J6.2/SCK/SCL(PB2/SCK/SCL) U$73.1(P) U$81.1(P) U$82.1(P) U$83.1(P) U$196.1(P) U$203.1(P) U$204.1(P) U$205.1(P) U$318.1(P) U$325.1(P) U$326.1(P) U$327.1(P) U$440.1(P) U$447.1(P) U$448.1(P) U$449.1(P) U$562.1(P) U$569.1(P) U$570.1(P) U$571.1(P) U$684.1(P) U$691.1(P) U$692.1(P) U$693.1(P)
PB3: IC1.PB3 IC2.PB3 IC3.PB3 IC4.PB3 IC5.PB3 IC6.PB3 U$84.1(P) U$85.1(P) U$86.1(P) U$206.1(P) U$207.1(P) U$208.1(P) U$328.1(P) U$329.1(P) U$330.1(P) U$450.1(P) U$451.1(P) U$452.1(P) U$572.1(P) U$573.1(P) U$574.1(P) U$694.1(P) U$695.1(P) U$696.1(P)
PB4: IC1.PB4 IC2.PB4 IC3.PB4 IC4.PB4 IC5.PB4 IC6.PB4 U$87.1(P) U$88.1(P) U$89.1(P) U$209.1(P) U$210.1(P) U$211.1(P) U$331.1(P) U$332.1(P) U$333.1(P) U$453.1(P) U$454.1(P) U$455.1(P) U$575.1(P) U$576.1(P) U$577.1(P) U$697.1(P) U$698.1(P) U$699.1(P)
PB5: IC1.PB5 IC2.PB5 IC3.PB5 IC4.PB5 IC5.PB5 IC6.PB5 J1.5/RST(PB5/RST) J2.5/RST(PB5/RST) J3.5/RST(PB5/RST) J4.5/RST(PB5/RST) J5.5/RST(PB5/RST) J6.5/RST(PB5/RST) U$90.1(P) U$91.1(P) U$92.1(P) U$212.1(P) U$213.1(P) U$214.1(P) U$334.1(P) U$335.1(P) U$336.1(P) U$456.1(P) U$457.1(P) U$458.1(P) U$578.1(P) U$579.1(P) U$580.1(P) U$700.1(P) U$701.1(P) U$702.1(P)
VCC [VCC]: C1.2 C2.2 C3.2 C4.2 C5.2 C6.2 IC1.VCC IC2.VCC IC3.VCC IC4.VCC IC5.VCC IC6.VCC J1.VCC J2.VCC J3.VCC J4.VCC J5.VCC J6.VCC R1.P$2 R3.P$2 R5.P$2 R7.P$2 R9.P$2 R11.P$2 U$74.1(P) U$194.1(P) U$316.1(P) U$438.1(P) U$560.1(P) U$682.1(P) VCC1.P$1 VCC1.P$2 VCC1.P$3 VCC1.P$4 VCC1.P$5 VCC1.P$6 VCC1.P$7 VCC1.P$8 VCC1.P$9 VCC1.P$10 VCC2.P$1 VCC2.P$2 VCC2.P$3 VCC2.P$4 VCC2.P$5 VCC2.P$6 VCC2.P$7 VCC2.P$8 VCC2.P$9 VCC2.P$10 VCC3.P$1 VCC3.P$2 VCC3.P$3 VCC3.P$4 VCC3.P$5 VCC3.P$6 VCC3.P$7 VCC3.P$8 VCC3.P$9 VCC3.P$10 VCC4.P$1 VCC4.P$2 VCC4.P$3 VCC4.P$4 VCC4.P$5 VCC4.P$6 VCC4.P$7 VCC4.P$8 VCC4.P$9 VCC4.P$10 VCC5.P$1 VCC5.P$2 VCC5.P$3 VCC5.P$4 VCC5.P$5 VCC5.P$6 VCC5.P$7 VCC5.P$8 VCC5.P$9 VCC5.P$10 VCC.P$1 VCC.P$2 VCC.P$3 VCC.P$4 VCC.P$5 VCC.P$6 VCC.P$7 VCC.P$8 VCC.P$9 VCC.P$10
Unconnected: U$1.1(P) U$2.1(P) U$3.1(P) U$4.1(P) U$5.1(P) U$6.1(P) U$7.1(P) U$8.1(P) U$9.1(P) U$10.1(P) U$11.1(P) U$12.1(P) U$13.1(P) U$14.1(P) U$15.1(P) U$16.1(P) U$17.1(P) U$18.1(P) U$19.1(P) U$20.1(P) U$21.1(P) U$22.1(P) U$23.1(P) U$24.1(P) U$25.1(P) U$26.1(P) U$27.1(P) U$28.1(P) U$29.1(P) U$30.1(P) U$31.1(P) U$32.1(P) U$33.1(P) U$34.1(P) U$35.1(P) U$36.1(P) U$37.1(P) U$38.1(P) U$39.1(P) U$40.1(P) U$41.1(P) U$42.1(P) U$43.1(P) U$44.1(P) U$45.1(P) U$46.1(P) U$47.1(P) U$48.1(P) U$49.1(P) U$50.1(P) U$51.1(P) U$52.1(P) U$53.1(P) U$54.1(P) U$55.1(P) U$56.1(P) U$57.1(P) U$58.1(P) U$59.1(P) U$60.1(P) U$61.1(P) U$62.1(P) U$63.1(P) U$64.1(P) U$65.1(P) U$66.1(P) U$67.1(P) U$68.1(P) U$69.1(P) U$70.1(P) U$93.1(P) U$94.1(P) U$95.1(P) U$96.1(P) U$97.1(P) U$98.1(P) U$99.1(P) U$100.1(P) U$101.1(P) U$102.1(P) U$103.1(P) U$104.1(P) U$105.1(P) U$106.1(P) U$107.1(P) U$108.1(P) U$109.1(P) U$110.1(P) U$111.1(P) U$112.1(P) U$113.1(P) U$114.1(P) U$115.1(P) U$116.1(P) U$117.1(P) U$118.1(P) U$119.1(P) U$120.1(P) U$121.1(P) U$122.1(P) U$123.1(P) U$124.1(P) U$125.1(P) U$126.1(P) U$127.1(P) U$128.1(P) U$129.1(P) U$130.1(P) U$131.1(P) U$132.1(P) U$133.1(P) U$134.1(P) U$135.1(P) U$136.1(P) U$137.1(P) U$138.1(P) U$139.1(P) U$140.1(P) U$141.1(P) U$142.1(P) U$143.1(P) U$144.1(P) U$145.1(P) U$146.1(P) U$147.1(P) U$148.1(P) U$149.1(P) U$150.1(P) U$151.1(P) U$152.1(P) U$153.1(P) U$154.1(P) U$155.1(P) U$156.1(P) U$157.1(P) U$158.1(P) U$159.1(P) U$160.1(P) U$161.1(P) U$162.1(P) U$163.1(P) U$164.1(P) U$165.1(P) U$166.1(P) U$167.1(P) U$168.1(P) U$169.1(P) U$170.1(P) U$171.1(P) U$172.1(P) U$173.1(P) U$174.1(P) U$175.1(P) U$176.1(P) U$177.1(P) U$178.1(P) U$179.1(P) U$180.1(P) U$181.1(P) U$182.1(P) U$183.1(P) U$184.1(P) U$185.1(P) U$186.1(P) U$187.1(P) U$188.1(P) U$189.1(P) U$190.1(P) U$191.1(P) U$192.1(P) U$215.1(P) U$216.1(P) U$217.1(P) U$218.1(P) U$219.1(P) U$220.1(P) U$221.1(P) U$222.1(P) U$223.1(P) U$224.1(P) U$225.1(P) U$226.1(P) U$227.1(P) U$228.1(P) U$229.1(P) U$230.1(P) U$231.1(P) U$232.1(P) U$233.1(P) U$234.1(P) U$235.1(P) U$236.1(P) U$237.1(P) U$238.1(P) U$239.1(P) U$240.1(P) U$241.1(P) U$242.1(P) U$243.1(P) U$244.1(P) U$245.1(P) U$246.1(P) U$247.1(P) U$248.1(P) U$249.1(P) U$250.1(P) U$251.1(P) U$252.1(P) U$253.1(P) U$254.1(P) U$255.1(P) U$256.1(P) U$257.1(P) U$258.1(P) U$259.1(P) U$260.1(P) U$261.1(P) U$262.1(P) U$263.1(P) U$264.1(P) U$265.1(P) U$266.1(P) U$267.1(P) U$268.1(P) U$269.1(P) U$270.1(P) U$271.1(P) U$272.1(P) U$273.1(P) U$274.1(P) U$275.1(P) U$276.1(P) U$277.1(P) U$278.1(P) U$279.1(P) U$280.1(P) U$281.1(P) U$282.1(P) U$283.1(P) U$284.1(P) U$285.1(P) U$286.1(P) U$287.1(P) U$288.1(P) U$289.1(P) U$290.1(P) U$291.1(P) U$292.1(P) U$293.1(P) U$294.1(P) U$295.1(P) U$296.1(P) U$297.1(P) U$298.1(P) U$299.1(P) U$300.1(P) U$301.1(P) U$302.1(P) U$303.1(P) U$304.1(P) U$305.1(P) U$306.1(P) U$307.1(P) U$308.1(P) U$309.1(P) U$310.1(P) U$311.1(P) U$312.1(P) U$313.1(P) U$314.1(P) U$337.1(P) U$338.1(P) U$339.1(P) U$340.1(P) U$341.1(P) U$342.1(P) U$343.1(P) U$344.1(P) U$345.1(P) U$346.1(P) U$347.1(P) U$348.1(P) U$349.1(P) U$350.1(P) U$351.1(P) U$352.1(P) U$353.1(P) U$354.1(P) U$355.1(P) U$356.1(P) U$357.1(P) U$358.1(P) U$359.1(P) U$360.1(P) U$361.1(P) U$362.1(P) U$363.1(P) U$364.1(P) U$365.1(P) U$366.1(P) U$367.1(P) U$368.1(P) U$369.1(P) U$370.1(P) U$371.1(P) U$372.1(P) U$373.1(P) U$374.1(P) U$375.1(P) U$376.1(P) U$377.1(P) U$378.1(P) U$379.1(P) U$380.1(P) U$381.1(P) U$382.1(P) U$383.1(P) U$384.1(P) U$385.1(P) U$386.1(P) U$387.1(P) U$388.1(P) U$389.1(P) U$390.1(P) U$391.1(P) U$392.1(P) U$393.1(P) U$394.1(P) U$395.1(P) U$396.1(P) U$397.1(P) U$398.1(P) U$399.1(P) U$400.1(P) U$401.1(P) U$402.1(P) U$403.1(P) U$404.1(P) U$405.1(P) U$406.1(P) U$407.1(P) U$408.1(P) U$409.1(P) U$410.1(P) U$411.1(P) U$412.1(P) U$413.1(P) U$414.1(P) U$415.1(P) U$416.1(P) U$417.1(P) U$418.1(P) U$419.1(P) U$420.1(P) U$421.1(P) U$422.1(P) U$423.1(P) U$424.1(P) U$425.1(P) U$426.1(P) U$427.1(P) U$428.1(P) U$429.1(P) U$430.1(P) U$431.1(P) U$432.1(P) U$433.1(P) U$434.1(P) U$435.1(P) U$436.1(P) U$459.1(P) U$460.1(P) U$461.1(P) U$462.1(P) U$463.1(P) U$464.1(P) U$465.1(P) U$466.1(P) U$467.1(P) U$468.1(P) U$469.1(P) U$470.1(P) U$471.1(P) U$472.1(P) U$473.1(P) U$474.1(P) U$475.1(P) U$476.1(P) U$477.1(P) U$478.1(P) U$479.1(P) U$480.1(P) U$481.1(P) U$482.1(P) U$483.1(P) U$484.1(P) U$485.1(P) U$486.1(P) U$487.1(P) U$488.1(P) U$489.1(P) U$490.1(P) U$491.1(P) U$492.1(P) U$493.1(P) U$494.1(P) U$495.1(P) U$496.1(P) U$497.1(P) U$498.1(P) U$499.1(P) U$500.1(P) U$501.1(P) U$502.1(P) U$503.1(P) U$504.1(P) U$505.1(P) U$506.1(P) U$507.1(P) U$508.1(P) U$509.1(P) U$510.1(P) U$511.1(P) U$512.1(P) U$513.1(P) U$514.1(P) U$515.1(P) U$516.1(P) U$517.1(P) U$518.1(P) U$519.1(P) U$520.1(P) U$521.1(P) U$522.1(P) U$523.1(P) U$524.1(P) U$525.1(P) U$526.1(P) U$527.1(P) U$528.1(P) U$529.1(P) U$530.1(P) U$531.1(P) U$532.1(P) U$533.1(P) U$534.1(P) U$535.1(P) U$536.1(P) U$537.1(P) U$538.1(P) U$539.1(P) U$540.1(P) U$541.1(P) U$542.1(P) U$543.1(P) U$544.1(P) U$545.1(P) U$546.1(P) U$547.1(P) U$548.1(P) U$549.1(P) U$550.1(P) U$551.1(P) U$552.1(P) U$553.1(P) U$554.1(P) U$555.1(P) U$556.1(P) U$557.1(P) U$558.1(P) U$581.1(P) U$582.1(P) U$583.1(P) U$584.1(P) U$585.1(P) U$586.1(P) U$587.1(P) U$588.1(P) U$589.1(P) U$590.1(P) U$591.1(P) U$592.1(P) U$593.1(P) U$594.1(P) U$595.1(P) U$596.1(P) U$597.1(P) U$598.1(P) U$599.1(P) U$600.1(P) U$601.1(P) U$602.1(P) U$603.1(P) U$604.1(P) U$605.1(P) U$606.1(P) U$607.1(P) U$608.1(P) U$609.1(P) U$610.1(P) U$611.1(P) U$612.1(P) U$613.1(P) U$614.1(P) U$615.1(P) U$616.1(P) U$617.1(P) U$618.1(P) U$619.1(P) U$620.1(P) U$621.1(P) U$622.1(P) U$623.1(P) U$624.1(P) U$625.1(P) U$626.1(P) U$627.1(P) U$628.1(P) U$629.1(P) U$630.1(P) U$631.1(P) U$632.1(P) U$633.1(P) U$634.1(P) U$635.1(P) U$636.1(P) U$637.1(P) U$638.1(P) U$639.1(P) U$640.1(P) U$641.1(P) U$642.1(P) U$643.1(P) U$644.1(P) U$645.1(P) U$646.1(P) U$647.1(P) U$648.1(P) U$649.1(P) U$650.1(P) U$651.1(P) U$652.1(P) U$653.1(P) U$654.1(P) U$655.1(P) U$656.1(P) U$657.1(P) U$658.1(P) U$659.1(P) U$660.1(P) U$661.1(P) U$662.1(P) U$663.1(P) U$664.1(P) U$665.1(P) U$666.1(P) U$667.1(P) U$668.1(P) U$669.1(P) U$670.1(P) U$671.1(P) U$672.1(P) U$673.1(P) U$674.1(P) U$675.1(P) U$676.1(P) U$677.1(P) U$678.1(P) U$679.1(P) U$680.1(P) U$703.1(P) U$704.1(P) U$705.1(P) U$706.1(P) U$707.1(P) U$708.1(P) U$709.1(P) U$710.1(P) U$711.1(P) U$712.1(P) U$713.1(P) U$714.1(P) U$715.1(P) U$716.1(P) U$717.1(P) U$718.1(P) U$719.1(P) U$720.1(P) U$721.1(P) U$722.1(P) U$723.1(P) U$724.1(P) U$725.1(P) U$726.1(P) U$727.1(P) U$728.1(P) U$729.1(P) U$730.1(P) U$731.1(P) U$732.1(P)

## Library data of the parts
C1-C6 = SparkFun-Capacitors:0.1UF: 0.1µF ceramic capacitors A capacitor is a passive two-terminal electrical component used to store electrical energy temporarily in an electric field.; PROD_ID: CAP-08604
GND GND1-GND5 VCC VCC1-VCC5 = BadgeParts:10X-PADS
HELLO HELLO1-HELLO5 POWER POWER1-POWER5 = BadgeParts:LED3MM
IC1-IC6 = BadgeParts:ATTINY85-20SU: MICROCHIP - ATTINY85-20SU - MICROCONTROLLER MCU, 8 BIT, ATTINY, 20MHZ, SOIC-8 Source: Datasheet <https://componentsearchengine.com/Datasheets/2/ATTINY85-20SU.pdf>; ARROW_PART_NUMBER: ATTINY85-20SU; ARROW_PRICE/STOCK: https://www.arrow.com/en/products/attiny85-20su/microchip-technology; DESCRIPTION: MICROCHIP - ATTINY85-20SU - MICROCONTROLLER MCU, 8 BIT, ATTINY, 20MHZ, SOIC-8; HEIGHT: 2.16mm; MANUFACTURER_NAME: Microchip; MANUFACTURER_PART_NUMBER: ATTINY85-20SU; RS_PART_NUMBER: 1331674; RS_PRICE/STOCK: http://uk.rs-online.com/web/p/products/1331674
J1-J6 = BadgeParts:M20-9980346: 03+03 DIL Vertical Pin Header HARWIN M20 Series, 2.54mm Pitch 6 Way 2 Row Straight PCB Header, Solder Termination, 3A Source: Datasheet <https://cdn.harwin.com/pdfs/M20-998.pdf?utm_source=3D_PDF&utm_medium=3D_PDF&utm_campaign=3D_PDF>; ARROW_PART_NUMBER: M20-9980346; ARROW_PRICE/STOCK: http://uk.rs-online.com/web/p/products/7457046P; DESCRIPTION: 03+03 DIL Vertical Pin Header HARWIN M20 Series, 2.54mm Pitch 6 Way 2 Row Straight PCB Header, Solder Termination, 3A; HEIGHT: 8.68mm; MANUFACTURER_NAME: HARWIN; MANUFACTURER_PART_NUMBER: M20-9980346; RS_PART_NUMBER: 7457046P; RS_PRICE/STOCK: http://uk.rs-online.com/web/p/products/7457046P
R1-R12 = SparkFun-Resistors:RESISTOR: Generic Resistor Package
U$1-U$732 = BadgeParts:ONE_PAD

## Net classes
0 default: width 0.254 mm, clearance 0.381 mm
1 VCC: width 0.635 mm, clearance 0.381 mm
2 GND: width 0.635 mm, clearance 0.381 mm